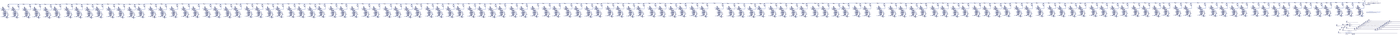
[diagram p0: schematic 128b_no_A_to_B.asc, whole sheet]
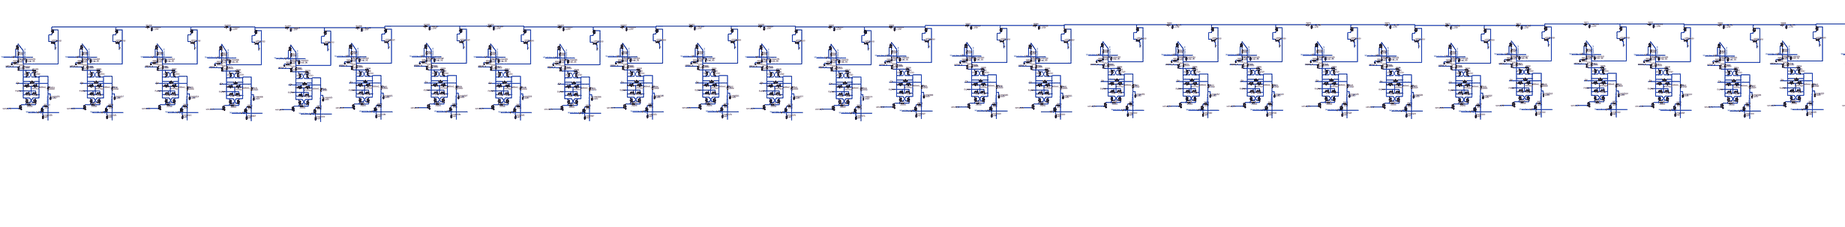
[diagram p1: schematic 128b_no_A_to_B.asc, part, row 1 of 1, column 1 of 5]
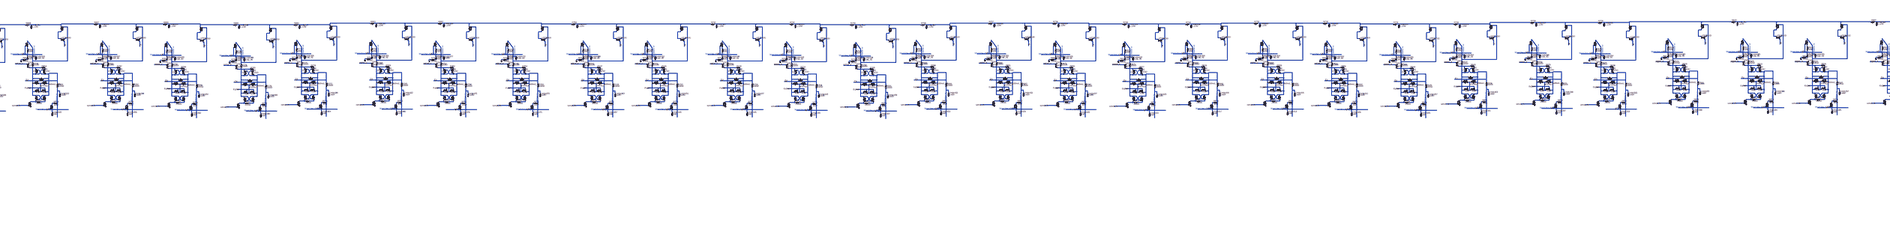
[diagram p2: schematic 128b_no_A_to_B.asc, part, row 1 of 1, column 2 of 5]
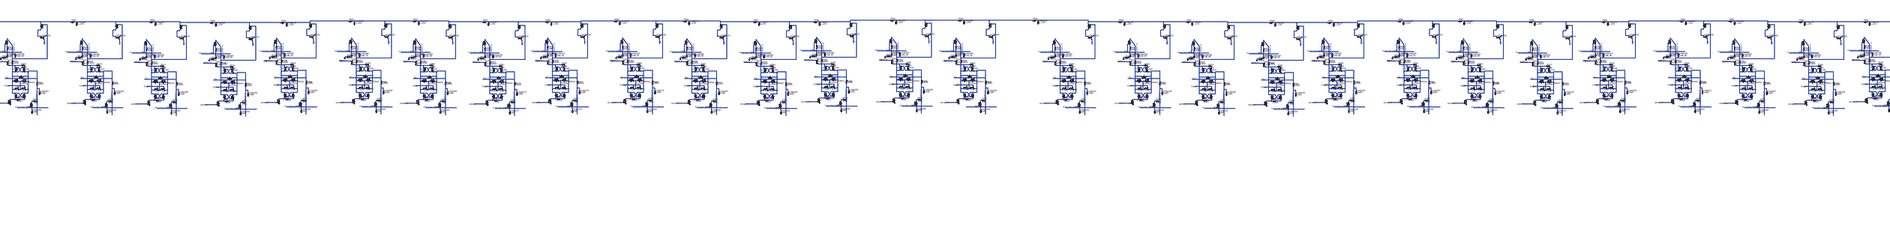
[diagram p3: schematic 128b_no_A_to_B.asc, part, row 1 of 1, column 3 of 5]
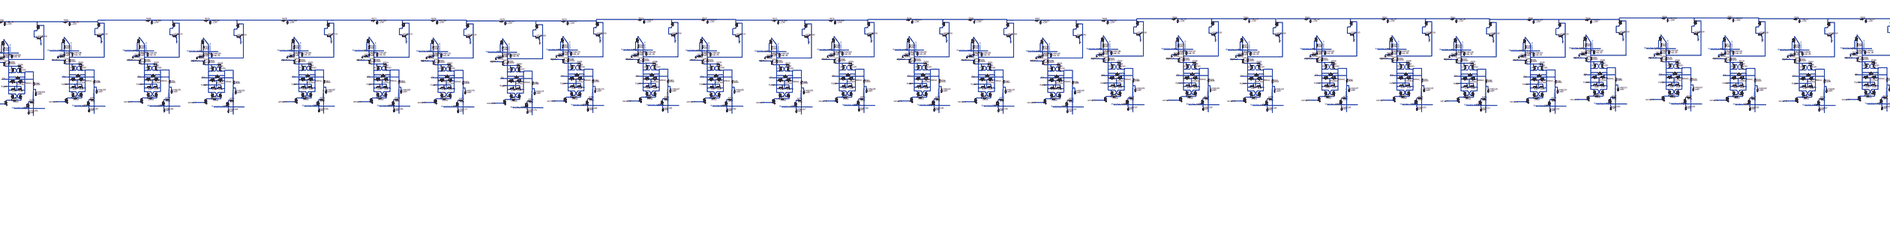
[diagram p4: schematic 128b_no_A_to_B.asc, part, row 1 of 1, column 4 of 5]
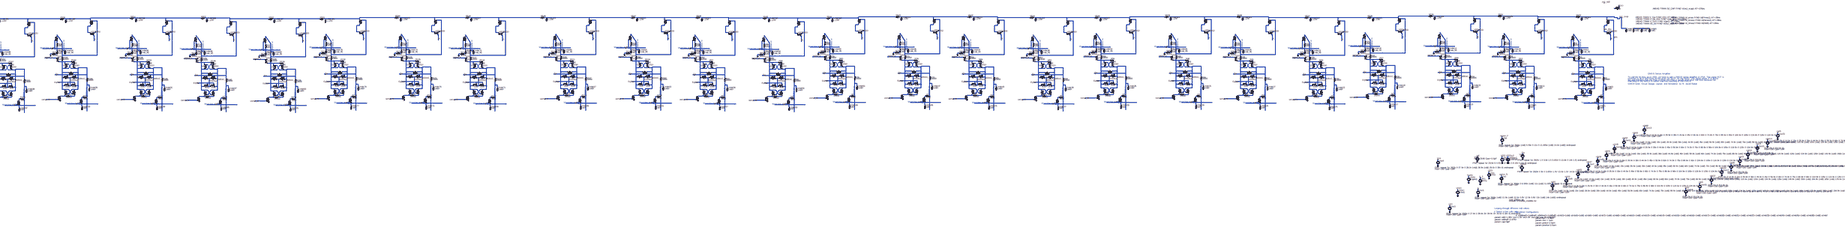
[diagram p5: schematic 128b_no_A_to_B.asc, part, row 1 of 1, column 5 of 5]
* 128b_no_A_to_B.asc
M1 N1046 sense_N 0 0 nmos45lp l=0.27um w=0.22um
VDD VDD 0 {vdd}
VDDby2 VDDby2 0 {vddhalf}
Vsp sense_P 0 PWL repeat for 20(6n {vdd} 6.05n 0 11n 0 11.005n {vdd} 14.0n {vdd}) endrepeat Rser=100 Cpar=10fF
M2 bitline1_1 bitline0_1 N1047 0 nmos45hp l=0.16um w={ntw}
M3 bitline0_1 bitline1_1 N1046 0 nmos45hp l=0.16um w={ntw}
M4 bitline1_1 Eq bitline0_1 0 nmos45hp l=0.16um w={prentw}
M5 bitline0_1 Eq VDDby2 0 nmos45hp l=0.16um w={prentw}
M6 VDDby2 Eq bitline1_1 0 nmos45hp l=0.16um w={prentw}
M7 gn1 ra0 N391 0 nmos45lp l=0.085um w=0.555um
Cmbit0 mb1 N519 24fF
M8 N1089 ra3 N1404 0 nmos45lp l=0.085um w=0.055um
Cmbit1 N1404 0 24fF
Vra0 ra0 0 PWL repeat for 20(4n 0 4.01n 2.9 9.9n 2.9 10n 0 14n 0) endrepeat Rser=2048 Cpar=0.6pF
M9 N634 sense_P VDD VDD pmos45lp l=0.27um w=0.22um
M10 bitline1_1 bitline0_1 N672 VDD pmos45hp l=0.16um w={tw}
M11 bitline0_1 bitline1_1 N634 VDD pmos45hp l=0.16um w={tw}
Vsn sense_N 0 PWL repeat for 20(6n 0 6.005n {vdd} 11n {vdd} 11.005n 0 14.0n 0) endrepeat Rser=100 Cpar=10fF
Cmbit2 gn1 0 {cap_bl}
Cmbit3 N903 0 144fF
R1 gn1 bitline0_1 10000
R2 bitline1_1 N903 10000
R4 0 N519 30000
R3 N391 mb1 1000
R5 N903 N1089 1000
R6 N672 N634 25000
R7 N1047 N1046 25000
M12 bitline0_1 EqNot VDDby2 VDD pmos45hp l=0.16um w={pretw}
M13 VDDby2 EqNot bitline1_1 VDD pmos45hp l=0.16um w={pretw}
Veq1 EqNot 0 PWL repeat for 20(0n 0 3n 0 3.001n 1.5V 13.9n 1.5V 14.0n 0) endrepeat
Veq2 Eq 0 PWL repeat for 20(0n 1.5 3.0n 1.5 3.001n 0 13.9n 0 14n 1.5) endrepeat
Cmbit4 N280 0 {cap}
Cmbit5 N280 0 {cap}
Cmbit6 N280 0 {cap}
Cmbit7 ns1_vcap 0 {cap}
M§NMOS1 dp_dn1 gn1 ns1_vcap 0 nmos45hp l=0.16um w={ntw}
M§PMOS1 dp_dn1 K VDD VDD pmos45hp l=0.16um w={tw}
VSS VSS 0 {vss}
M20 N001 ISO NC_01 0 nmos45hp l=0.16um w={ntw}
VSS1 Vgate 0 {vgate}
Vsn1 K 0 PWL repeat for 20(0n {vdd} 11.9n {vdd} 12.0n 0.8V 12.9n 0.8V 13n {vdd} 14n {vdd}) endrepeat Rser=100 Cpar=10fF
Vsn2 Vcp 0 PWL repeat for 20(0n 0 27.9n 0 28.0n {vdd} 28.9n {vdd} 29.0n 0 30n 0) endrepeat Rser=100 Cpar=10fF
VK1 K_1 0 {vk1}
VISO VISO 0 {viso}
Vsn3 ISO 0 PWL repeat for 20(0n 0 27.9n 0 28.0n 3V 29.5n 3V 29.6n 0 30n 0) endrepeat Rser=100 Cpar=10fF
M14 N1029 sense_N 0 0 nmos45lp l=0.27um w=0.22um
M15 bitline1_2 bitline0_2 N1030 0 nmos45hp l=0.16um w={ntw}
M16 bitline0_2 bitline1_2 N1029 0 nmos45hp l=0.16um w={ntw}
M17 bitline1_2 Eq bitline0_2 0 nmos45hp l=0.16um w={prentw}
M18 bitline0_2 Eq VDDby2 0 nmos45hp l=0.16um w={prentw}
M19 VDDby2 Eq bitline1_2 0 nmos45hp l=0.16um w={prentw}
M21 N048 ra0 N384 0 nmos45lp l=0.085um w=0.555um
Cmbit8 mb2 N511 24fF
M22 N1068 ra3 N1385 0 nmos45lp l=0.085um w=0.055um
Cmbit9 N1385 0 24fF
M23 N619 sense_P VDD VDD pmos45lp l=0.27um w=0.22um
M24 bitline1_2 bitline0_2 N653 VDD pmos45hp l=0.16um w={tw}
M25 bitline0_2 bitline1_2 N619 VDD pmos45hp l=0.16um w={tw}
Cmbit10 N048 0 {cap_bl}
Cmbit11 N896 0 144fF
R8 N048 bitline0_2 10000
R9 bitline1_2 N896 10000
R10 0 N511 30000
R11 N384 mb2 1000
R12 N896 N1068 1000
R13 N653 N619 25000
R14 N1030 N1029 25000
M26 bitline0_2 EqNot VDDby2 VDD pmos45hp l=0.16um w={pretw}
M27 VDDby2 EqNot bitline1_2 VDD pmos45hp l=0.16um w={pretw}
M§NMOS2 N183 N048 N004 0 nmos45hp l=0.16um w={ntw}
M§PMOS2 N183 K VDD VDD pmos45hp l=0.16um w={tw}
M28 N1016 sense_N 0 0 nmos45lp l=0.27um w=0.22um
M29 bitline1_3 bitline0_3 N1017 0 nmos45hp l=0.16um w={ntw}
M30 bitline0_3 bitline1_3 N1016 0 nmos45hp l=0.16um w={ntw}
M31 bitline1_3 Eq bitline0_3 0 nmos45hp l=0.16um w={prentw}
M32 bitline0_3 Eq VDDby2 0 nmos45hp l=0.16um w={prentw}
M33 VDDby2 Eq bitline1_3 0 nmos45hp l=0.16um w={prentw}
M34 N036 ra0 N379 0 nmos45lp l=0.085um w=0.555um
Cmbit12 mb3 N503 24fF
M35 N1045 ra3 N1364 0 nmos45lp l=0.085um w=0.055um
Cmbit13 N1364 0 24fF
M36 N605 sense_P VDD VDD pmos45lp l=0.27um w=0.22um
M37 bitline1_3 bitline0_3 N633 VDD pmos45hp l=0.16um w={tw}
M38 bitline0_3 bitline1_3 N605 VDD pmos45hp l=0.16um w={tw}
Cmbit14 N036 0 {cap_bl}
Cmbit15 N891 0 144fF
R15 N036 bitline0_3 10000
R16 bitline1_3 N891 10000
R17 0 N503 30000
R18 N379 mb3 1000
R19 N891 N1045 1000
R20 N633 N605 25000
R21 N1017 N1016 25000
M39 bitline0_3 EqNot VDDby2 VDD pmos45hp l=0.16um w={pretw}
M40 VDDby2 EqNot bitline1_3 VDD pmos45hp l=0.16um w={pretw}
M§NMOS3 N160 N036 N003 0 nmos45hp l=0.16um w={ntw}
M§PMOS3 N160 K VDD VDD pmos45hp l=0.16um w={tw}
M41 N1014 sense_N 0 0 nmos45lp l=0.27um w=0.22um
M42 bitline1_4 bitline0_4 N1015 0 nmos45hp l=0.16um w={ntw}
M43 bitline0_4 bitline1_4 N1014 0 nmos45hp l=0.16um w={ntw}
M44 bitline1_4 Eq bitline0_4 0 nmos45hp l=0.16um w={prentw}
M45 bitline0_4 Eq VDDby2 0 nmos45hp l=0.16um w={prentw}
M46 VDDby2 Eq bitline1_4 0 nmos45hp l=0.16um w={prentw}
M47 N035 ra0 N378 0 nmos45lp l=0.085um w=0.555um
Cmbit16 mb4 N502 24fF
M48 N1044 ra3 N1363 0 nmos45lp l=0.085um w=0.055um
Cmbit17 N1363 0 24fF
M49 N604 sense_P VDD VDD pmos45lp l=0.27um w=0.22um
M50 bitline1_4 bitline0_4 N632 VDD pmos45hp l=0.16um w={tw}
M51 bitline0_4 bitline1_4 N604 VDD pmos45hp l=0.16um w={tw}
Cmbit18 N035 0 {cap_bl}
Cmbit19 N890 0 144fF
R22 N035 bitline0_4 10000
R23 bitline1_4 N890 10000
R24 0 N502 30000
R25 N378 mb4 1000
R26 N890 N1044 1000
R27 N632 N604 25000
R28 N1015 N1014 25000
M52 bitline0_4 EqNot VDDby2 VDD pmos45hp l=0.16um w={pretw}
M53 VDDby2 EqNot bitline1_4 VDD pmos45hp l=0.16um w={pretw}
M§NMOS4 N159 N035 N002 0 nmos45hp l=0.16um w={ntw}
M§PMOS4 N159 K VDD VDD pmos45hp l=0.16um w={tw}
M54 N1066 sense_N 0 0 nmos45lp l=0.27um w=0.22um
M55 bitline1_5 bitline0_5 N1067 0 nmos45hp l=0.16um w={ntw}
M56 bitline0_5 bitline1_5 N1066 0 nmos45hp l=0.16um w={ntw}
M57 bitline1_5 Eq bitline0_5 0 nmos45hp l=0.16um w={prentw}
M58 bitline0_5 Eq VDDby2 0 nmos45hp l=0.16um w={prentw}
M59 VDDby2 Eq bitline1_5 0 nmos45hp l=0.16um w={prentw}
M60 N087 ra0 N399 0 nmos45lp l=0.085um w=0.555um
Cmbit20 mb5 N527 24fF
M61 N1113 ra3 N1419 0 nmos45lp l=0.085um w=0.055um
Cmbit21 N1419 0 24fF
M62 N652 sense_P VDD VDD pmos45lp l=0.27um w=0.22um
M63 bitline1_5 bitline0_5 N691 VDD pmos45hp l=0.16um w={tw}
M64 bitline0_5 bitline1_5 N652 VDD pmos45hp l=0.16um w={tw}
Cmbit22 N087 0 {cap_bl}
Cmbit23 N911 0 144fF
R29 N087 bitline0_5 10000
R30 bitline1_5 N911 10000
R31 0 N527 30000
R32 N399 mb5 1000
R33 N911 N1113 1000
R34 N691 N652 25000
R35 N1067 N1066 25000
M65 bitline0_5 EqNot VDDby2 VDD pmos45hp l=0.16um w={pretw}
M66 VDDby2 EqNot bitline1_5 VDD pmos45hp l=0.16um w={pretw}
M§NMOS5 N223 N087 N018 0 nmos45hp l=0.16um w={ntw}
M§PMOS5 N223 K VDD VDD pmos45hp l=0.16um w={tw}
M67 N1042 sense_N 0 0 nmos45lp l=0.27um w=0.22um
M68 bitline1_6 bitline0_6 N1043 0 nmos45hp l=0.16um w={ntw}
M69 bitline0_6 bitline1_6 N1042 0 nmos45hp l=0.16um w={ntw}
M70 bitline1_6 Eq bitline0_6 0 nmos45hp l=0.16um w={prentw}
M71 bitline0_6 Eq VDDby2 0 nmos45hp l=0.16um w={prentw}
M72 VDDby2 Eq bitline1_6 0 nmos45hp l=0.16um w={prentw}
M73 N066 ra0 N390 0 nmos45lp l=0.085um w=0.555um
Cmbit24 mb6 N518 24fF
M74 N1088 ra3 N1403 0 nmos45lp l=0.085um w=0.055um
Cmbit25 N1403 0 24fF
M75 N631 sense_P VDD VDD pmos45lp l=0.27um w=0.22um
M76 bitline1_6 bitline0_6 N671 VDD pmos45hp l=0.16um w={tw}
M77 bitline0_6 bitline1_6 N631 VDD pmos45hp l=0.16um w={tw}
Cmbit26 N066 0 {cap_bl}
Cmbit27 N902 0 144fF
R36 N066 bitline0_6 10000
R37 bitline1_6 N902 10000
R38 0 N518 30000
R39 N390 mb6 1000
R40 N902 N1088 1000
R41 N671 N631 25000
R42 N1043 N1042 25000
M78 bitline0_6 EqNot VDDby2 VDD pmos45hp l=0.16um w={pretw}
M79 VDDby2 EqNot bitline1_6 VDD pmos45hp l=0.16um w={pretw}
M§NMOS6 N200 N066 N010 0 nmos45hp l=0.16um w={ntw}
M§PMOS6 N200 K VDD VDD pmos45hp l=0.16um w={tw}
M80 N1027 sense_N 0 0 nmos45lp l=0.27um w=0.22um
M81 bitline1_7 bitline0_7 N1028 0 nmos45hp l=0.16um w={ntw}
M82 bitline0_7 bitline1_7 N1027 0 nmos45hp l=0.16um w={ntw}
M83 bitline1_7 Eq bitline0_7 0 nmos45hp l=0.16um w={prentw}
M84 bitline0_7 Eq VDDby2 0 nmos45hp l=0.16um w={prentw}
M85 VDDby2 Eq bitline1_7 0 nmos45hp l=0.16um w={prentw}
M86 N047 ra0 N383 0 nmos45lp l=0.085um w=0.555um
Cmbit28 mb7 N510 24fF
M87 N1065 ra3 N1384 0 nmos45lp l=0.085um w=0.055um
Cmbit29 N1384 0 24fF
M88 N618 sense_P VDD VDD pmos45lp l=0.27um w=0.22um
M89 bitline1_7 bitline0_7 N651 VDD pmos45hp l=0.16um w={tw}
M90 bitline0_7 bitline1_7 N618 VDD pmos45hp l=0.16um w={tw}
Cmbit30 N047 0 {cap_bl}
Cmbit31 N895 0 144fF
R43 N047 bitline0_7 10000
R44 bitline1_7 N895 10000
R45 0 N510 30000
R46 N383 mb7 1000
R47 N895 N1065 1000
R48 N651 N618 25000
R49 N1028 N1027 25000
M91 bitline0_7 EqNot VDDby2 VDD pmos45hp l=0.16um w={pretw}
M92 VDDby2 EqNot bitline1_7 VDD pmos45hp l=0.16um w={pretw}
M§NMOS7 N182 N047 N009 0 nmos45hp l=0.16um w={ntw}
M§PMOS7 N182 K VDD VDD pmos45hp l=0.16um w={tw}
M93 N1025 sense_N 0 0 nmos45lp l=0.27um w=0.22um
M94 bitline1_8 bitline0_8 N1026 0 nmos45hp l=0.16um w={ntw}
M95 bitline0_8 bitline1_8 N1025 0 nmos45hp l=0.16um w={ntw}
M96 bitline1_8 Eq bitline0_8 0 nmos45hp l=0.16um w={prentw}
M97 bitline0_8 Eq VDDby2 0 nmos45hp l=0.16um w={prentw}
M98 VDDby2 Eq bitline1_8 0 nmos45hp l=0.16um w={prentw}
M99 N046 ra0 N382 0 nmos45lp l=0.085um w=0.555um
Cmbit32 mb8 N509 24fF
M100 N1064 ra3 N1383 0 nmos45lp l=0.085um w=0.055um
Cmbit33 N1383 0 24fF
M101 N617 sense_P VDD VDD pmos45lp l=0.27um w=0.22um
M102 bitline1_8 bitline0_8 N650 VDD pmos45hp l=0.16um w={tw}
M103 bitline0_8 bitline1_8 N617 VDD pmos45hp l=0.16um w={tw}
Cmbit34 N046 0 {cap_bl}
Cmbit35 N894 0 144fF
R50 N046 bitline0_8 10000
R51 bitline1_8 N894 10000
R52 0 N509 30000
R53 N382 mb8 1000
R54 N894 N1064 1000
R55 N650 N617 25000
R56 N1026 N1025 25000
M104 bitline0_8 EqNot VDDby2 VDD pmos45hp l=0.16um w={pretw}
M105 VDDby2 EqNot bitline1_8 VDD pmos45hp l=0.16um w={pretw}
M§NMOS8 N181 N046 N008 0 nmos45hp l=0.16um w={ntw}
M§PMOS8 N181 K VDD VDD pmos45hp l=0.16um w={tw}
M106 N1062 sense_N 0 0 nmos45lp l=0.27um w=0.22um
M107 bitline1_9 bitline0_9 N1063 0 nmos45hp l=0.16um w={ntw}
M108 bitline0_9 bitline1_9 N1062 0 nmos45hp l=0.16um w={ntw}
M109 bitline1_9 Eq bitline0_9 0 nmos45hp l=0.16um w={prentw}
M110 bitline0_9 Eq VDDby2 0 nmos45hp l=0.16um w={prentw}
M111 VDDby2 Eq bitline1_9 0 nmos45hp l=0.16um w={prentw}
M112 N086 ra0 N398 0 nmos45lp l=0.085um w=0.555um
Cmbit36 mb9 N526 24fF
M113 N1112 ra3 N1418 0 nmos45lp l=0.085um w=0.055um
Cmbit37 N1418 0 24fF
M114 N649 sense_P VDD VDD pmos45lp l=0.27um w=0.22um
M115 bitline1_9 bitline0_9 N690 VDD pmos45hp l=0.16um w={tw}
M116 bitline0_9 bitline1_9 N649 VDD pmos45hp l=0.16um w={tw}
Cmbit38 N086 0 {cap_bl}
Cmbit39 N910 0 144fF
R57 N086 bitline0_9 10000
R58 bitline1_9 N910 10000
R59 0 N526 30000
R60 N398 mb9 1000
R61 N910 N1112 1000
R62 N690 N649 25000
R63 N1063 N1062 25000
M117 bitline0_9 EqNot VDDby2 VDD pmos45hp l=0.16um w={pretw}
M118 VDDby2 EqNot bitline1_9 VDD pmos45hp l=0.16um w={pretw}
M§NMOS9 N222 N086 N017 0 nmos45hp l=0.16um w={ntw}
M§PMOS9 N222 K VDD VDD pmos45hp l=0.16um w={tw}
M119 N1040 sense_N 0 0 nmos45lp l=0.27um w=0.22um
M120 bitline1_10 bitline0_10 N1041 0 nmos45hp l=0.16um w={ntw}
M121 bitline0_10 bitline1_10 N1040 0 nmos45hp l=0.16um w={ntw}
M122 bitline1_10 Eq bitline0_10 0 nmos45hp l=0.16um w={prentw}
M123 bitline0_10 Eq VDDby2 0 nmos45hp l=0.16um w={prentw}
M124 VDDby2 Eq bitline1_10 0 nmos45hp l=0.16um w={prentw}
M125 N065 ra0 N389 0 nmos45lp l=0.085um w=0.555um
Cmbit40 mb10 N517 24fF
M126 N1087 ra3 N1402 0 nmos45lp l=0.085um w=0.055um
Cmbit41 N1402 0 24fF
M127 N630 sense_P VDD VDD pmos45lp l=0.27um w=0.22um
M128 bitline1_10 bitline0_10 N670 VDD pmos45hp l=0.16um w={tw}
M129 bitline0_10 bitline1_10 N630 VDD pmos45hp l=0.16um w={tw}
Cmbit42 N065 0 {cap_bl}
Cmbit43 N901 0 144fF
R64 N065 bitline0_10 10000
R65 bitline1_10 N901 10000
R66 0 N517 30000
R67 N389 mb10 1000
R68 N901 N1087 1000
R69 N670 N630 25000
R70 N1041 N1040 25000
M130 bitline0_10 EqNot VDDby2 VDD pmos45hp l=0.16um w={pretw}
M131 VDDby2 EqNot bitline1_10 VDD pmos45hp l=0.16um w={pretw}
M§NMOS10 N199 N065 N007 0 nmos45hp l=0.16um w={ntw}
M§PMOS10 N199 K VDD VDD pmos45hp l=0.16um w={tw}
M132 N1023 sense_N 0 0 nmos45lp l=0.27um w=0.22um
M133 bitline1_11 bitline0_11 N1024 0 nmos45hp l=0.16um w={ntw}
M134 bitline0_11 bitline1_11 N1023 0 nmos45hp l=0.16um w={ntw}
M135 bitline1_11 Eq bitline0_11 0 nmos45hp l=0.16um w={prentw}
M136 bitline0_11 Eq VDDby2 0 nmos45hp l=0.16um w={prentw}
M137 VDDby2 Eq bitline1_11 0 nmos45hp l=0.16um w={prentw}
M138 N045 ra0 N381 0 nmos45lp l=0.085um w=0.555um
Cmbit44 mb11 N508 24fF
M139 N1061 ra3 N1382 0 nmos45lp l=0.085um w=0.055um
Cmbit45 N1382 0 24fF
M140 N616 sense_P VDD VDD pmos45lp l=0.27um w=0.22um
M141 bitline1_11 bitline0_11 N648 VDD pmos45hp l=0.16um w={tw}
M142 bitline0_11 bitline1_11 N616 VDD pmos45hp l=0.16um w={tw}
Cmbit46 N045 0 {cap_bl}
Cmbit47 N893 0 144fF
R71 N045 bitline0_11 10000
R72 bitline1_11 N893 10000
R73 0 N508 30000
R74 N381 mb11 1000
R75 N893 N1061 1000
R76 N648 N616 25000
R77 N1024 N1023 25000
M143 bitline0_11 EqNot VDDby2 VDD pmos45hp l=0.16um w={pretw}
M144 VDDby2 EqNot bitline1_11 VDD pmos45hp l=0.16um w={pretw}
M§NMOS11 N180 N045 N006 0 nmos45hp l=0.16um w={ntw}
M§PMOS11 N180 K VDD VDD pmos45hp l=0.16um w={tw}
M145 N1021 sense_N 0 0 nmos45lp l=0.27um w=0.22um
M146 bitline1_12 bitline0_12 N1022 0 nmos45hp l=0.16um w={ntw}
M147 bitline0_12 bitline1_12 N1021 0 nmos45hp l=0.16um w={ntw}
M148 bitline1_12 Eq bitline0_12 0 nmos45hp l=0.16um w={prentw}
M149 bitline0_12 Eq VDDby2 0 nmos45hp l=0.16um w={prentw}
M150 VDDby2 Eq bitline1_12 0 nmos45hp l=0.16um w={prentw}
M151 N044 ra0 N380 0 nmos45lp l=0.085um w=0.555um
Cmbit48 mb12 N507 24fF
M152 N1060 ra3 N1381 0 nmos45lp l=0.085um w=0.055um
Cmbit49 N1381 0 24fF
M153 N615 sense_P VDD VDD pmos45lp l=0.27um w=0.22um
M154 bitline1_12 bitline0_12 N647 VDD pmos45hp l=0.16um w={tw}
M155 bitline0_12 bitline1_12 N615 VDD pmos45hp l=0.16um w={tw}
Cmbit50 N044 0 {cap_bl}
Cmbit51 N892 0 144fF
R78 N044 bitline0_12 10000
R79 bitline1_12 N892 10000
R80 0 N507 30000
R81 N380 mb12 1000
R82 N892 N1060 1000
R83 N647 N615 25000
R84 N1022 N1021 25000
M156 bitline0_12 EqNot VDDby2 VDD pmos45hp l=0.16um w={pretw}
M157 VDDby2 EqNot bitline1_12 VDD pmos45hp l=0.16um w={pretw}
M§NMOS12 N179 N044 N005 0 nmos45hp l=0.16um w={ntw}
M§PMOS12 N179 K VDD VDD pmos45hp l=0.16um w={tw}
M158 N1085 sense_N 0 0 nmos45lp l=0.27um w=0.22um
M159 bitline1_13 bitline0_13 N1086 0 nmos45hp l=0.16um w={ntw}
M160 bitline0_13 bitline1_13 N1085 0 nmos45hp l=0.16um w={ntw}
M161 bitline1_13 Eq bitline0_13 0 nmos45hp l=0.16um w={prentw}
M162 bitline0_13 Eq VDDby2 0 nmos45hp l=0.16um w={prentw}
M163 VDDby2 Eq bitline1_13 0 nmos45hp l=0.16um w={prentw}
M164 N104 ra0 N406 0 nmos45lp l=0.085um w=0.555um
Cmbit52 mb13 N534 24fF
M165 N1138 ra3 N1429 0 nmos45lp l=0.085um w=0.055um
Cmbit53 N1429 0 24fF
M166 N669 sense_P VDD VDD pmos45lp l=0.27um w=0.22um
M167 bitline1_13 bitline0_13 N708 VDD pmos45hp l=0.16um w={tw}
M168 bitline0_13 bitline1_13 N669 VDD pmos45hp l=0.16um w={tw}
Cmbit54 N104 0 {cap_bl}
Cmbit55 N918 0 144fF
R85 N104 bitline0_13 10000
R86 bitline1_13 N918 10000
R87 0 N534 30000
R88 N406 mb13 1000
R89 N918 N1138 1000
R90 N708 N669 25000
R91 N1086 N1085 25000
M169 bitline0_13 EqNot VDDby2 VDD pmos45hp l=0.16um w={pretw}
M170 VDDby2 EqNot bitline1_13 VDD pmos45hp l=0.16um w={pretw}
M§NMOS13 N246 N104 N025 0 nmos45hp l=0.16um w={ntw}
M§PMOS13 N246 K VDD VDD pmos45hp l=0.16um w={tw}
M171 N1058 sense_N 0 0 nmos45lp l=0.27um w=0.22um
M172 bitline1_14 bitline0_14 N1059 0 nmos45hp l=0.16um w={ntw}
M173 bitline0_14 bitline1_14 N1058 0 nmos45hp l=0.16um w={ntw}
M174 bitline1_14 Eq bitline0_14 0 nmos45hp l=0.16um w={prentw}
M175 bitline0_14 Eq VDDby2 0 nmos45hp l=0.16um w={prentw}
M176 VDDby2 Eq bitline1_14 0 nmos45hp l=0.16um w={prentw}
M177 N085 ra0 N397 0 nmos45lp l=0.085um w=0.555um
Cmbit56 mb14 N525 24fF
M178 N1111 ra3 N1417 0 nmos45lp l=0.085um w=0.055um
Cmbit57 N1417 0 24fF
M179 N646 sense_P VDD VDD pmos45lp l=0.27um w=0.22um
M180 bitline1_14 bitline0_14 N689 VDD pmos45hp l=0.16um w={tw}
M181 bitline0_14 bitline1_14 N646 VDD pmos45hp l=0.16um w={tw}
Cmbit58 N085 0 {cap_bl}
Cmbit59 N909 0 144fF
R92 N085 bitline0_14 10000
R93 bitline1_14 N909 10000
R94 0 N525 30000
R95 N397 mb14 1000
R96 N909 N1111 1000
R97 N689 N646 25000
R98 N1059 N1058 25000
M182 bitline0_14 EqNot VDDby2 VDD pmos45hp l=0.16um w={pretw}
M183 VDDby2 EqNot bitline1_14 VDD pmos45hp l=0.16um w={pretw}
M§NMOS14 N221 N085 N016 0 nmos45hp l=0.16um w={ntw}
M§PMOS14 N221 K VDD VDD pmos45hp l=0.16um w={tw}
M184 N1038 sense_N 0 0 nmos45lp l=0.27um w=0.22um
M185 bitline1_15 bitline0_15 N1039 0 nmos45hp l=0.16um w={ntw}
M186 bitline0_15 bitline1_15 N1038 0 nmos45hp l=0.16um w={ntw}
M187 bitline1_15 Eq bitline0_15 0 nmos45hp l=0.16um w={prentw}
M188 bitline0_15 Eq VDDby2 0 nmos45hp l=0.16um w={prentw}
M189 VDDby2 Eq bitline1_15 0 nmos45hp l=0.16um w={prentw}
M190 N064 ra0 N388 0 nmos45lp l=0.085um w=0.555um
Cmbit60 mb15 N516 24fF
M191 N1084 ra3 N1401 0 nmos45lp l=0.085um w=0.055um
Cmbit61 N1401 0 24fF
M192 N629 sense_P VDD VDD pmos45lp l=0.27um w=0.22um
M193 bitline1_15 bitline0_15 N668 VDD pmos45hp l=0.16um w={tw}
M194 bitline0_15 bitline1_15 N629 VDD pmos45hp l=0.16um w={tw}
Cmbit62 N064 0 {cap_bl}
Cmbit63 N900 0 144fF
R99 N064 bitline0_15 10000
R100 bitline1_15 N900 10000
R101 0 N516 30000
R102 N388 mb15 1000
R103 N900 N1084 1000
R104 N668 N629 25000
R105 N1039 N1038 25000
M195 bitline0_15 EqNot VDDby2 VDD pmos45hp l=0.16um w={pretw}
M196 VDDby2 EqNot bitline1_15 VDD pmos45hp l=0.16um w={pretw}
M§NMOS15 N198 N064 N015 0 nmos45hp l=0.16um w={ntw}
M§PMOS15 N198 K VDD VDD pmos45hp l=0.16um w={tw}
M197 N1036 sense_N 0 0 nmos45lp l=0.27um w=0.22um
M198 bitline1_16 bitline0_16 N1037 0 nmos45hp l=0.16um w={ntw}
M199 bitline0_16 bitline1_16 N1036 0 nmos45hp l=0.16um w={ntw}
M200 bitline1_16 Eq bitline0_16 0 nmos45hp l=0.16um w={prentw}
M201 bitline0_16 Eq VDDby2 0 nmos45hp l=0.16um w={prentw}
M202 VDDby2 Eq bitline1_16 0 nmos45hp l=0.16um w={prentw}
M203 N063 ra0 N387 0 nmos45lp l=0.085um w=0.555um
Cmbit64 mb16 N515 24fF
M204 N1083 ra3 N1400 0 nmos45lp l=0.085um w=0.055um
Cmbit65 N1400 0 24fF
M205 N628 sense_P VDD VDD pmos45lp l=0.27um w=0.22um
M206 bitline1_16 bitline0_16 N667 VDD pmos45hp l=0.16um w={tw}
M207 bitline0_16 bitline1_16 N628 VDD pmos45hp l=0.16um w={tw}
Cmbit66 N063 0 {cap_bl}
Cmbit67 N899 0 144fF
R106 N063 bitline0_16 10000
R107 bitline1_16 N899 10000
R108 0 N515 30000
R109 N387 mb16 1000
R110 N899 N1083 1000
R111 N667 N628 25000
R112 N1037 N1036 25000
M208 bitline0_16 EqNot VDDby2 VDD pmos45hp l=0.16um w={pretw}
M209 VDDby2 EqNot bitline1_16 VDD pmos45hp l=0.16um w={pretw}
M§NMOS16 N197 N063 N014 0 nmos45hp l=0.16um w={ntw}
M§PMOS16 N197 K VDD VDD pmos45hp l=0.16um w={tw}
M210 N1056 sense_N 0 0 nmos45lp l=0.27um w=0.22um
M211 bitline1_17 bitline0_17 N1057 0 nmos45hp l=0.16um w={ntw}
M212 bitline0_17 bitline1_17 N1056 0 nmos45hp l=0.16um w={ntw}
M213 bitline1_17 Eq bitline0_17 0 nmos45hp l=0.16um w={prentw}
M214 bitline0_17 Eq VDDby2 0 nmos45hp l=0.16um w={prentw}
M215 VDDby2 Eq bitline1_17 0 nmos45hp l=0.16um w={prentw}
M216 N084 ra0 N396 0 nmos45lp l=0.085um w=0.555um
Cmbit68 mb17 N524 24fF
M217 N1110 ra3 N1416 0 nmos45lp l=0.085um w=0.055um
Cmbit69 N1416 0 24fF
M218 N645 sense_P VDD VDD pmos45lp l=0.27um w=0.22um
M219 bitline1_17 bitline0_17 N688 VDD pmos45hp l=0.16um w={tw}
M220 bitline0_17 bitline1_17 N645 VDD pmos45hp l=0.16um w={tw}
Cmbit70 N084 0 {cap_bl}
Cmbit71 N908 0 144fF
R113 N084 bitline0_17 10000
R114 bitline1_17 N908 10000
R115 0 N524 30000
R116 N396 mb17 1000
R117 N908 N1110 1000
R118 N688 N645 25000
R119 N1057 N1056 25000
M221 bitline0_17 EqNot VDDby2 VDD pmos45hp l=0.16um w={pretw}
M222 VDDby2 EqNot bitline1_17 VDD pmos45hp l=0.16um w={pretw}
M§NMOS17 N220 N084 N013 0 nmos45hp l=0.16um w={ntw}
M§PMOS17 N220 K VDD VDD pmos45hp l=0.16um w={tw}
M223 N1034 sense_N 0 0 nmos45lp l=0.27um w=0.22um
M224 bitline1_18 bitline0_18 N1035 0 nmos45hp l=0.16um w={ntw}
M225 bitline0_18 bitline1_18 N1034 0 nmos45hp l=0.16um w={ntw}
M226 bitline1_18 Eq bitline0_18 0 nmos45hp l=0.16um w={prentw}
M227 bitline0_18 Eq VDDby2 0 nmos45hp l=0.16um w={prentw}
M228 VDDby2 Eq bitline1_18 0 nmos45hp l=0.16um w={prentw}
M229 N062 ra0 N386 0 nmos45lp l=0.085um w=0.555um
Cmbit72 mb18 N514 24fF
M230 N1082 ra3 N1399 0 nmos45lp l=0.085um w=0.055um
Cmbit73 N1399 0 24fF
M231 N627 sense_P VDD VDD pmos45lp l=0.27um w=0.22um
M232 bitline1_18 bitline0_18 N666 VDD pmos45hp l=0.16um w={tw}
M233 bitline0_18 bitline1_18 N627 VDD pmos45hp l=0.16um w={tw}
Cmbit74 N062 0 {cap_bl}
Cmbit75 N898 0 144fF
R120 N062 bitline0_18 10000
R121 bitline1_18 N898 10000
R122 0 N514 30000
R123 N386 mb18 1000
R124 N898 N1082 1000
R125 N666 N627 25000
R126 N1035 N1034 25000
M234 bitline0_18 EqNot VDDby2 VDD pmos45hp l=0.16um w={pretw}
M235 VDDby2 EqNot bitline1_18 VDD pmos45hp l=0.16um w={pretw}
M§NMOS18 N196 N062 N012 0 nmos45hp l=0.16um w={ntw}
M§PMOS18 N196 K VDD VDD pmos45hp l=0.16um w={tw}
M236 N1032 sense_N 0 0 nmos45lp l=0.27um w=0.22um
M237 bitline1_19 bitline0_19 N1033 0 nmos45hp l=0.16um w={ntw}
M238 bitline0_19 bitline1_19 N1032 0 nmos45hp l=0.16um w={ntw}
M239 bitline1_19 Eq bitline0_19 0 nmos45hp l=0.16um w={prentw}
M240 bitline0_19 Eq VDDby2 0 nmos45hp l=0.16um w={prentw}
M241 VDDby2 Eq bitline1_19 0 nmos45hp l=0.16um w={prentw}
M242 N061 ra0 N385 0 nmos45lp l=0.085um w=0.555um
Cmbit76 mb19 N513 24fF
M243 N1081 ra3 N1398 0 nmos45lp l=0.085um w=0.055um
Cmbit77 N1398 0 24fF
M244 N626 sense_P VDD VDD pmos45lp l=0.27um w=0.22um
M245 bitline1_19 bitline0_19 N665 VDD pmos45hp l=0.16um w={tw}
M246 bitline0_19 bitline1_19 N626 VDD pmos45hp l=0.16um w={tw}
Cmbit78 N061 0 {cap_bl}
Cmbit79 N897 0 144fF
R127 N061 bitline0_19 10000
R128 bitline1_19 N897 10000
R129 0 N513 30000
R130 N385 mb19 1000
R131 N897 N1081 1000
R132 N665 N626 25000
R133 N1033 N1032 25000
M247 bitline0_19 EqNot VDDby2 VDD pmos45hp l=0.16um w={pretw}
M248 VDDby2 EqNot bitline1_19 VDD pmos45hp l=0.16um w={pretw}
M§NMOS19 N195 N061 N011 0 nmos45hp l=0.16um w={ntw}
M§PMOS19 N195 K VDD VDD pmos45hp l=0.16um w={tw}
M249 N1108 sense_N 0 0 nmos45lp l=0.27um w=0.22um
M250 bitline1_20 bitline0_20 N1109 0 nmos45hp l=0.16um w={ntw}
M251 bitline0_20 bitline1_20 N1108 0 nmos45hp l=0.16um w={ntw}
M252 bitline1_20 Eq bitline0_20 0 nmos45hp l=0.16um w={prentw}
M253 bitline0_20 Eq VDDby2 0 nmos45hp l=0.16um w={prentw}
M254 VDDby2 Eq bitline1_20 0 nmos45hp l=0.16um w={prentw}
M255 N116 ra0 N414 0 nmos45lp l=0.085um w=0.555um
Cmbit80 mb20 N542 24fF
M256 N1172 ra3 N1438 0 nmos45lp l=0.085um w=0.055um
Cmbit81 N1438 0 24fF
M257 N687 sense_P VDD VDD pmos45lp l=0.27um w=0.22um
M258 bitline1_20 bitline0_20 N729 VDD pmos45hp l=0.16um w={tw}
M259 bitline0_20 bitline1_20 N687 VDD pmos45hp l=0.16um w={tw}
Cmbit82 N116 0 {cap_bl}
Cmbit83 N926 0 144fF
R134 N116 bitline0_20 10000
R135 bitline1_20 N926 10000
R136 0 N542 30000
R137 N414 mb20 1000
R138 N926 N1172 1000
R139 N729 N687 25000
R140 N1109 N1108 25000
M260 bitline0_20 EqNot VDDby2 VDD pmos45hp l=0.16um w={pretw}
M261 VDDby2 EqNot bitline1_20 VDD pmos45hp l=0.16um w={pretw}
M§NMOS20 N264 N116 N034 0 nmos45hp l=0.16um w={ntw}
M§PMOS20 N264 K VDD VDD pmos45hp l=0.16um w={tw}
M262 N1079 sense_N 0 0 nmos45lp l=0.27um w=0.22um
M263 bitline1_21 bitline0_21 N1080 0 nmos45hp l=0.16um w={ntw}
M264 bitline0_21 bitline1_21 N1079 0 nmos45hp l=0.16um w={ntw}
M265 bitline1_21 Eq bitline0_21 0 nmos45hp l=0.16um w={prentw}
M266 bitline0_21 Eq VDDby2 0 nmos45hp l=0.16um w={prentw}
M267 VDDby2 Eq bitline1_21 0 nmos45hp l=0.16um w={prentw}
M268 N103 ra0 N405 0 nmos45lp l=0.085um w=0.555um
Cmbit84 mb21 N533 24fF
M269 N1137 ra3 N1428 0 nmos45lp l=0.085um w=0.055um
Cmbit85 N1428 0 24fF
M270 N664 sense_P VDD VDD pmos45lp l=0.27um w=0.22um
M271 bitline1_21 bitline0_21 N707 VDD pmos45hp l=0.16um w={tw}
M272 bitline0_21 bitline1_21 N664 VDD pmos45hp l=0.16um w={tw}
Cmbit86 N103 0 {cap_bl}
Cmbit87 N917 0 144fF
R141 N103 bitline0_21 10000
R142 bitline1_21 N917 10000
R143 0 N533 30000
R144 N405 mb21 1000
R145 N917 N1137 1000
R146 N707 N664 25000
R147 N1080 N1079 25000
M273 bitline0_21 EqNot VDDby2 VDD pmos45hp l=0.16um w={pretw}
M274 VDDby2 EqNot bitline1_21 VDD pmos45hp l=0.16um w={pretw}
M§NMOS21 N245 N103 N024 0 nmos45hp l=0.16um w={ntw}
M§PMOS21 N245 K VDD VDD pmos45hp l=0.16um w={tw}
M275 N1054 sense_N 0 0 nmos45lp l=0.27um w=0.22um
M276 bitline1_22 bitline0_22 N1055 0 nmos45hp l=0.16um w={ntw}
M277 bitline0_22 bitline1_22 N1054 0 nmos45hp l=0.16um w={ntw}
M278 bitline1_22 Eq bitline0_22 0 nmos45hp l=0.16um w={prentw}
M279 bitline0_22 Eq VDDby2 0 nmos45hp l=0.16um w={prentw}
M280 VDDby2 Eq bitline1_22 0 nmos45hp l=0.16um w={prentw}
M281 N083 ra0 N395 0 nmos45lp l=0.085um w=0.555um
Cmbit88 mb22 N523 24fF
M282 N1107 ra3 N1415 0 nmos45lp l=0.085um w=0.055um
Cmbit89 N1415 0 24fF
M283 N644 sense_P VDD VDD pmos45lp l=0.27um w=0.22um
M284 bitline1_22 bitline0_22 N686 VDD pmos45hp l=0.16um w={tw}
M285 bitline0_22 bitline1_22 N644 VDD pmos45hp l=0.16um w={tw}
Cmbit90 N083 0 {cap_bl}
Cmbit91 N907 0 144fF
R148 N083 bitline0_22 10000
R149 bitline1_22 N907 10000
R150 0 N523 30000
R151 N395 mb22 1000
R152 N907 N1107 1000
R153 N686 N644 25000
R154 N1055 N1054 25000
M286 bitline0_22 EqNot VDDby2 VDD pmos45hp l=0.16um w={pretw}
M287 VDDby2 EqNot bitline1_22 VDD pmos45hp l=0.16um w={pretw}
M§NMOS22 N219 N083 N023 0 nmos45hp l=0.16um w={ntw}
M§PMOS22 N219 K VDD VDD pmos45hp l=0.16um w={tw}
M288 N1052 sense_N 0 0 nmos45lp l=0.27um w=0.22um
M289 bitline1_23 bitline0_23 N1053 0 nmos45hp l=0.16um w={ntw}
M290 bitline0_23 bitline1_23 N1052 0 nmos45hp l=0.16um w={ntw}
M291 bitline1_23 Eq bitline0_23 0 nmos45hp l=0.16um w={prentw}
M292 bitline0_23 Eq VDDby2 0 nmos45hp l=0.16um w={prentw}
M293 VDDby2 Eq bitline1_23 0 nmos45hp l=0.16um w={prentw}
M294 N082 ra0 N394 0 nmos45lp l=0.085um w=0.555um
Cmbit92 mb23 N522 24fF
M295 N1106 ra3 N1414 0 nmos45lp l=0.085um w=0.055um
Cmbit93 N1414 0 24fF
M296 N643 sense_P VDD VDD pmos45lp l=0.27um w=0.22um
M297 bitline1_23 bitline0_23 N685 VDD pmos45hp l=0.16um w={tw}
M298 bitline0_23 bitline1_23 N643 VDD pmos45hp l=0.16um w={tw}
Cmbit94 N082 0 {cap_bl}
Cmbit95 N906 0 144fF
R155 N082 bitline0_23 10000
R156 bitline1_23 N906 10000
R157 0 N522 30000
R158 N394 mb23 1000
R159 N906 N1106 1000
R160 N685 N643 25000
R161 N1053 N1052 25000
M299 bitline0_23 EqNot VDDby2 VDD pmos45hp l=0.16um w={pretw}
M300 VDDby2 EqNot bitline1_23 VDD pmos45hp l=0.16um w={pretw}
M§NMOS23 N218 N082 N022 0 nmos45hp l=0.16um w={ntw}
M§PMOS23 N218 K VDD VDD pmos45hp l=0.16um w={tw}
M301 N1104 sense_N 0 0 nmos45lp l=0.27um w=0.22um
M302 bitline1_24 bitline0_24 N1105 0 nmos45hp l=0.16um w={ntw}
M303 bitline0_24 bitline1_24 N1104 0 nmos45hp l=0.16um w={ntw}
M304 bitline1_24 Eq bitline0_24 0 nmos45hp l=0.16um w={prentw}
M305 bitline0_24 Eq VDDby2 0 nmos45hp l=0.16um w={prentw}
M306 VDDby2 Eq bitline1_24 0 nmos45hp l=0.16um w={prentw}
M307 N115 ra0 N413 0 nmos45lp l=0.085um w=0.555um
Cmbit96 mb24 N541 24fF
M308 N1171 ra3 N1437 0 nmos45lp l=0.085um w=0.055um
Cmbit97 N1437 0 24fF
M309 N684 sense_P VDD VDD pmos45lp l=0.27um w=0.22um
M310 bitline1_24 bitline0_24 N728 VDD pmos45hp l=0.16um w={tw}
M311 bitline0_24 bitline1_24 N684 VDD pmos45hp l=0.16um w={tw}
Cmbit98 N115 0 {cap_bl}
Cmbit99 N925 0 144fF
R162 N115 bitline0_24 10000
R163 bitline1_24 N925 10000
R164 0 N541 30000
R165 N413 mb24 1000
R166 N925 N1171 1000
R167 N728 N684 25000
R168 N1105 N1104 25000
M312 bitline0_24 EqNot VDDby2 VDD pmos45hp l=0.16um w={pretw}
M313 VDDby2 EqNot bitline1_24 VDD pmos45hp l=0.16um w={pretw}
M§NMOS24 N263 N115 N033 0 nmos45hp l=0.16um w={ntw}
M§PMOS24 N263 K VDD VDD pmos45hp l=0.16um w={tw}
M314 N1077 sense_N 0 0 nmos45lp l=0.27um w=0.22um
M315 bitline1_25 bitline0_25 N1078 0 nmos45hp l=0.16um w={ntw}
M316 bitline0_25 bitline1_25 N1077 0 nmos45hp l=0.16um w={ntw}
M317 bitline1_25 Eq bitline0_25 0 nmos45hp l=0.16um w={prentw}
M318 bitline0_25 Eq VDDby2 0 nmos45hp l=0.16um w={prentw}
M319 VDDby2 Eq bitline1_25 0 nmos45hp l=0.16um w={prentw}
M320 N102 ra0 N404 0 nmos45lp l=0.085um w=0.555um
Cmbit100 mb25 N532 24fF
M321 N1136 ra3 N1427 0 nmos45lp l=0.085um w=0.055um
Cmbit101 N1427 0 24fF
M322 N663 sense_P VDD VDD pmos45lp l=0.27um w=0.22um
M323 bitline1_25 bitline0_25 N706 VDD pmos45hp l=0.16um w={tw}
M324 bitline0_25 bitline1_25 N663 VDD pmos45hp l=0.16um w={tw}
Cmbit102 N102 0 {cap_bl}
Cmbit103 N916 0 144fF
R169 N102 bitline0_25 10000
R170 bitline1_25 N916 10000
R171 0 N532 30000
R172 N404 mb25 1000
R173 N916 N1136 1000
R174 N706 N663 25000
R175 N1078 N1077 25000
M325 bitline0_25 EqNot VDDby2 VDD pmos45hp l=0.16um w={pretw}
M326 VDDby2 EqNot bitline1_25 VDD pmos45hp l=0.16um w={pretw}
M§NMOS25 N244 N102 N021 0 nmos45hp l=0.16um w={ntw}
M§PMOS25 N244 K VDD VDD pmos45hp l=0.16um w={tw}
M327 N1050 sense_N 0 0 nmos45lp l=0.27um w=0.22um
M328 bitline1_26 bitline0_26 N1051 0 nmos45hp l=0.16um w={ntw}
M329 bitline0_26 bitline1_26 N1050 0 nmos45hp l=0.16um w={ntw}
M330 bitline1_26 Eq bitline0_26 0 nmos45hp l=0.16um w={prentw}
M331 bitline0_26 Eq VDDby2 0 nmos45hp l=0.16um w={prentw}
M332 VDDby2 Eq bitline1_26 0 nmos45hp l=0.16um w={prentw}
M333 N081 ra0 N393 0 nmos45lp l=0.085um w=0.555um
Cmbit104 mb26 N521 24fF
M334 N1103 ra3 N1413 0 nmos45lp l=0.085um w=0.055um
Cmbit105 N1413 0 24fF
M335 N642 sense_P VDD VDD pmos45lp l=0.27um w=0.22um
M336 bitline1_26 bitline0_26 N683 VDD pmos45hp l=0.16um w={tw}
M337 bitline0_26 bitline1_26 N642 VDD pmos45hp l=0.16um w={tw}
Cmbit106 N081 0 {cap_bl}
Cmbit107 N905 0 144fF
R176 N081 bitline0_26 10000
R177 bitline1_26 N905 10000
R178 0 N521 30000
R179 N393 mb26 1000
R180 N905 N1103 1000
R181 N683 N642 25000
R182 N1051 N1050 25000
M338 bitline0_26 EqNot VDDby2 VDD pmos45hp l=0.16um w={pretw}
M339 VDDby2 EqNot bitline1_26 VDD pmos45hp l=0.16um w={pretw}
M§NMOS26 N217 N081 N020 0 nmos45hp l=0.16um w={ntw}
M§PMOS26 N217 K VDD VDD pmos45hp l=0.16um w={tw}
M340 N1048 sense_N 0 0 nmos45lp l=0.27um w=0.22um
M341 bitline1_27 bitline0_27 N1049 0 nmos45hp l=0.16um w={ntw}
M342 bitline0_27 bitline1_27 N1048 0 nmos45hp l=0.16um w={ntw}
M343 bitline1_27 Eq bitline0_27 0 nmos45hp l=0.16um w={prentw}
M344 bitline0_27 Eq VDDby2 0 nmos45hp l=0.16um w={prentw}
M345 VDDby2 Eq bitline1_27 0 nmos45hp l=0.16um w={prentw}
M346 N080 ra0 N392 0 nmos45lp l=0.085um w=0.555um
Cmbit108 mb27 N520 24fF
M347 N1102 ra3 N1412 0 nmos45lp l=0.085um w=0.055um
Cmbit109 N1412 0 24fF
M348 N641 sense_P VDD VDD pmos45lp l=0.27um w=0.22um
M349 bitline1_27 bitline0_27 N682 VDD pmos45hp l=0.16um w={tw}
M350 bitline0_27 bitline1_27 N641 VDD pmos45hp l=0.16um w={tw}
Cmbit110 N080 0 {cap_bl}
Cmbit111 N904 0 144fF
R183 N080 bitline0_27 10000
R184 bitline1_27 N904 10000
R185 0 N520 30000
R186 N392 mb27 1000
R187 N904 N1102 1000
R188 N682 N641 25000
R189 N1049 N1048 25000
M351 bitline0_27 EqNot VDDby2 VDD pmos45hp l=0.16um w={pretw}
M352 VDDby2 EqNot bitline1_27 VDD pmos45hp l=0.16um w={pretw}
M§NMOS27 N216 N080 N019 0 nmos45hp l=0.16um w={ntw}
M§PMOS27 N216 K VDD VDD pmos45hp l=0.16um w={tw}
M353 N1134 sense_N 0 0 nmos45lp l=0.27um w=0.22um
M354 bitline1_28 bitline0_28 N1135 0 nmos45hp l=0.16um w={ntw}
M355 bitline0_28 bitline1_28 N1134 0 nmos45hp l=0.16um w={ntw}
M356 bitline1_28 Eq bitline0_28 0 nmos45hp l=0.16um w={prentw}
M357 bitline0_28 Eq VDDby2 0 nmos45hp l=0.16um w={prentw}
M358 VDDby2 Eq bitline1_28 0 nmos45hp l=0.16um w={prentw}
M359 N134 ra0 N423 0 nmos45lp l=0.085um w=0.555um
Cmbit112 mb28 N551 24fF
M360 N1203 ra3 N1447 0 nmos45lp l=0.085um w=0.055um
Cmbit113 N1447 0 24fF
M361 N705 sense_P VDD VDD pmos45lp l=0.27um w=0.22um
M362 bitline1_28 bitline0_28 N749 VDD pmos45hp l=0.16um w={tw}
M363 bitline0_28 bitline1_28 N705 VDD pmos45hp l=0.16um w={tw}
Cmbit114 N134 0 {cap_bl}
Cmbit115 N935 0 144fF
R190 N134 bitline0_28 10000
R191 bitline1_28 N935 10000
R192 0 N551 30000
R193 N423 mb28 1000
R194 N935 N1203 1000
R195 N749 N705 25000
R196 N1135 N1134 25000
M364 bitline0_28 EqNot VDDby2 VDD pmos45hp l=0.16um w={pretw}
M365 VDDby2 EqNot bitline1_28 VDD pmos45hp l=0.16um w={pretw}
M§NMOS28 N279 N134 N043 0 nmos45hp l=0.16um w={ntw}
M§PMOS28 N279 K VDD VDD pmos45hp l=0.16um w={tw}
M366 N1100 sense_N 0 0 nmos45lp l=0.27um w=0.22um
M367 bitline1_29 bitline0_29 N1101 0 nmos45hp l=0.16um w={ntw}
M368 bitline0_29 bitline1_29 N1100 0 nmos45hp l=0.16um w={ntw}
M369 bitline1_29 Eq bitline0_29 0 nmos45hp l=0.16um w={prentw}
M370 bitline0_29 Eq VDDby2 0 nmos45hp l=0.16um w={prentw}
M371 VDDby2 Eq bitline1_29 0 nmos45hp l=0.16um w={prentw}
M372 N114 ra0 N412 0 nmos45lp l=0.085um w=0.555um
Cmbit116 mb29 N540 24fF
M373 N1170 ra3 N1436 0 nmos45lp l=0.085um w=0.055um
Cmbit117 N1436 0 24fF
M374 N681 sense_P VDD VDD pmos45lp l=0.27um w=0.22um
M375 bitline1_29 bitline0_29 N727 VDD pmos45hp l=0.16um w={tw}
M376 bitline0_29 bitline1_29 N681 VDD pmos45hp l=0.16um w={tw}
Cmbit118 N114 0 {cap_bl}
Cmbit119 N924 0 144fF
R197 N114 bitline0_29 10000
R198 bitline1_29 N924 10000
R199 0 N540 30000
R200 N412 mb29 1000
R201 N924 N1170 1000
R202 N727 N681 25000
R203 N1101 N1100 25000
M377 bitline0_29 EqNot VDDby2 VDD pmos45hp l=0.16um w={pretw}
M378 VDDby2 EqNot bitline1_29 VDD pmos45hp l=0.16um w={pretw}
M§NMOS29 N262 N114 N032 0 nmos45hp l=0.16um w={ntw}
M§PMOS29 N262 K VDD VDD pmos45hp l=0.16um w={tw}
M379 N1075 sense_N 0 0 nmos45lp l=0.27um w=0.22um
M380 bitline1_30 bitline0_30 N1076 0 nmos45hp l=0.16um w={ntw}
M381 bitline0_30 bitline1_30 N1075 0 nmos45hp l=0.16um w={ntw}
M382 bitline1_30 Eq bitline0_30 0 nmos45hp l=0.16um w={prentw}
M383 bitline0_30 Eq VDDby2 0 nmos45hp l=0.16um w={prentw}
M384 VDDby2 Eq bitline1_30 0 nmos45hp l=0.16um w={prentw}
M385 N101 ra0 N403 0 nmos45lp l=0.085um w=0.555um
Cmbit120 mb30 N531 24fF
M386 N1133 ra3 N1426 0 nmos45lp l=0.085um w=0.055um
Cmbit121 N1426 0 24fF
M387 N662 sense_P VDD VDD pmos45lp l=0.27um w=0.22um
M388 bitline1_30 bitline0_30 N704 VDD pmos45hp l=0.16um w={tw}
M389 bitline0_30 bitline1_30 N662 VDD pmos45hp l=0.16um w={tw}
Cmbit122 N101 0 {cap_bl}
Cmbit123 N915 0 144fF
R204 N101 bitline0_30 10000
R205 bitline1_30 N915 10000
R206 0 N531 30000
R207 N403 mb30 1000
R208 N915 N1133 1000
R209 N704 N662 25000
R210 N1076 N1075 25000
M390 bitline0_30 EqNot VDDby2 VDD pmos45hp l=0.16um w={pretw}
M391 VDDby2 EqNot bitline1_30 VDD pmos45hp l=0.16um w={pretw}
M§NMOS30 N243 N101 N031 0 nmos45hp l=0.16um w={ntw}
M§PMOS30 N243 K VDD VDD pmos45hp l=0.16um w={tw}
M392 N1073 sense_N 0 0 nmos45lp l=0.27um w=0.22um
M393 bitline1_31 bitline0_31 N1074 0 nmos45hp l=0.16um w={ntw}
M394 bitline0_31 bitline1_31 N1073 0 nmos45hp l=0.16um w={ntw}
M395 bitline1_31 Eq bitline0_31 0 nmos45hp l=0.16um w={prentw}
M396 bitline0_31 Eq VDDby2 0 nmos45hp l=0.16um w={prentw}
M397 VDDby2 Eq bitline1_31 0 nmos45hp l=0.16um w={prentw}
M398 N100 ra0 N402 0 nmos45lp l=0.085um w=0.555um
Cmbit124 mb31 N530 24fF
M399 N1132 ra3 N1425 0 nmos45lp l=0.085um w=0.055um
Cmbit125 N1425 0 24fF
M400 N661 sense_P VDD VDD pmos45lp l=0.27um w=0.22um
M401 bitline1_31 bitline0_31 N703 VDD pmos45hp l=0.16um w={tw}
M402 bitline0_31 bitline1_31 N661 VDD pmos45hp l=0.16um w={tw}
Cmbit126 N100 0 {cap_bl}
Cmbit127 N914 0 144fF
R211 N100 bitline0_31 10000
R212 bitline1_31 N914 10000
R213 0 N530 30000
R214 N402 mb31 1000
R215 N914 N1132 1000
R216 N703 N661 25000
R217 N1074 N1073 25000
M403 bitline0_31 EqNot VDDby2 VDD pmos45hp l=0.16um w={pretw}
M404 VDDby2 EqNot bitline1_31 VDD pmos45hp l=0.16um w={pretw}
M§NMOS31 N242 N100 N030 0 nmos45hp l=0.16um w={ntw}
M§PMOS31 N242 K VDD VDD pmos45hp l=0.16um w={tw}
M405 N1098 sense_N 0 0 nmos45lp l=0.27um w=0.22um
M406 bitline1_32 bitline0_32 N1099 0 nmos45hp l=0.16um w={ntw}
M407 bitline0_32 bitline1_32 N1098 0 nmos45hp l=0.16um w={ntw}
M408 bitline1_32 Eq bitline0_32 0 nmos45hp l=0.16um w={prentw}
M409 bitline0_32 Eq VDDby2 0 nmos45hp l=0.16um w={prentw}
M410 VDDby2 Eq bitline1_32 0 nmos45hp l=0.16um w={prentw}
M411 N113 ra0 N411 0 nmos45lp l=0.085um w=0.555um
Cmbit128 mb32 N539 24fF
M412 N1169 ra3 N1435 0 nmos45lp l=0.085um w=0.055um
Cmbit129 N1435 0 24fF
M413 N680 sense_P VDD VDD pmos45lp l=0.27um w=0.22um
M414 bitline1_32 bitline0_32 N726 VDD pmos45hp l=0.16um w={tw}
M415 bitline0_32 bitline1_32 N680 VDD pmos45hp l=0.16um w={tw}
Cmbit130 N113 0 {cap_bl}
Cmbit131 N923 0 144fF
R218 N113 bitline0_32 10000
R219 bitline1_32 N923 10000
R220 0 N539 30000
R221 N411 mb32 1000
R222 N923 N1169 1000
R223 N726 N680 25000
R224 N1099 N1098 25000
M416 bitline0_32 EqNot VDDby2 VDD pmos45hp l=0.16um w={pretw}
M417 VDDby2 EqNot bitline1_32 VDD pmos45hp l=0.16um w={pretw}
M§NMOS32 N261 N113 N028 0 nmos45hp l=0.16um w={ntw}
M§PMOS32 N261 K VDD VDD pmos45hp l=0.16um w={tw}
M418 N1071 sense_N 0 0 nmos45lp l=0.27um w=0.22um
M419 bitline1_33 bitline0_33 N1072 0 nmos45hp l=0.16um w={ntw}
M420 bitline0_33 bitline1_33 N1071 0 nmos45hp l=0.16um w={ntw}
M421 bitline1_33 Eq bitline0_33 0 nmos45hp l=0.16um w={prentw}
M422 bitline0_33 Eq VDDby2 0 nmos45hp l=0.16um w={prentw}
M423 VDDby2 Eq bitline1_33 0 nmos45hp l=0.16um w={prentw}
M424 N099 ra0 N401 0 nmos45lp l=0.085um w=0.555um
Cmbit132 mb33 N529 24fF
M425 N1131 ra3 N1424 0 nmos45lp l=0.085um w=0.055um
Cmbit133 N1424 0 24fF
M426 N660 sense_P VDD VDD pmos45lp l=0.27um w=0.22um
M427 bitline1_33 bitline0_33 N702 VDD pmos45hp l=0.16um w={tw}
M428 bitline0_33 bitline1_33 N660 VDD pmos45hp l=0.16um w={tw}
Cmbit134 N099 0 {cap_bl}
Cmbit135 N913 0 144fF
R225 N099 bitline0_33 10000
R226 bitline1_33 N913 10000
R227 0 N529 30000
R228 N401 mb33 1000
R229 N913 N1131 1000
R230 N702 N660 25000
R231 N1072 N1071 25000
M429 bitline0_33 EqNot VDDby2 VDD pmos45hp l=0.16um w={pretw}
M430 VDDby2 EqNot bitline1_33 VDD pmos45hp l=0.16um w={pretw}
M§NMOS33 N241 N099 N027 0 nmos45hp l=0.16um w={ntw}
M§PMOS33 N241 K VDD VDD pmos45hp l=0.16um w={tw}
M431 N1069 sense_N 0 0 nmos45lp l=0.27um w=0.22um
M432 bitline1_34 bitline0_34 N1070 0 nmos45hp l=0.16um w={ntw}
M433 bitline0_34 bitline1_34 N1069 0 nmos45hp l=0.16um w={ntw}
M434 bitline1_34 Eq bitline0_34 0 nmos45hp l=0.16um w={prentw}
M435 bitline0_34 Eq VDDby2 0 nmos45hp l=0.16um w={prentw}
M436 VDDby2 Eq bitline1_34 0 nmos45hp l=0.16um w={prentw}
M437 N098 ra0 N400 0 nmos45lp l=0.085um w=0.555um
Cmbit136 mb34 N528 24fF
M438 N1130 ra3 N1423 0 nmos45lp l=0.085um w=0.055um
Cmbit137 N1423 0 24fF
M439 N659 sense_P VDD VDD pmos45lp l=0.27um w=0.22um
M440 bitline1_34 bitline0_34 N701 VDD pmos45hp l=0.16um w={tw}
M441 bitline0_34 bitline1_34 N659 VDD pmos45hp l=0.16um w={tw}
Cmbit138 N098 0 {cap_bl}
Cmbit139 N912 0 144fF
R232 N098 bitline0_34 10000
R233 bitline1_34 N912 10000
R234 0 N528 30000
R235 N400 mb34 1000
R236 N912 N1130 1000
R237 N701 N659 25000
R238 N1070 N1069 25000
M442 bitline0_34 EqNot VDDby2 VDD pmos45hp l=0.16um w={pretw}
M443 VDDby2 EqNot bitline1_34 VDD pmos45hp l=0.16um w={pretw}
M§NMOS34 N240 N098 N026 0 nmos45hp l=0.16um w={ntw}
M§PMOS34 N240 K VDD VDD pmos45hp l=0.16um w={tw}
M444 N1167 sense_N 0 0 nmos45lp l=0.27um w=0.22um
M445 bitline1_35 bitline0_35 N1168 0 nmos45hp l=0.16um w={ntw}
M446 bitline0_35 bitline1_35 N1167 0 nmos45hp l=0.16um w={ntw}
M447 bitline1_35 Eq bitline0_35 0 nmos45hp l=0.16um w={prentw}
M448 bitline0_35 Eq VDDby2 0 nmos45hp l=0.16um w={prentw}
M449 VDDby2 Eq bitline1_35 0 nmos45hp l=0.16um w={prentw}
M450 N158 ra0 N436 0 nmos45lp l=0.085um w=0.555um
Cmbit140 mb35 N564 24fF
M451 N1232 ra3 N1460 0 nmos45lp l=0.085um w=0.055um
Cmbit141 N1460 0 24fF
M452 N725 sense_P VDD VDD pmos45lp l=0.27um w=0.22um
M453 bitline1_35 bitline0_35 N770 VDD pmos45hp l=0.16um w={tw}
M454 bitline0_35 bitline1_35 N725 VDD pmos45hp l=0.16um w={tw}
Cmbit142 N158 0 {cap_bl}
Cmbit143 N948 0 144fF
R239 N158 bitline0_35 10000
R240 bitline1_35 N948 10000
R241 0 N564 30000
R242 N436 mb35 1000
R243 N948 N1232 1000
R244 N770 N725 25000
R245 N1168 N1167 25000
M455 bitline0_35 EqNot VDDby2 VDD pmos45hp l=0.16um w={pretw}
M456 VDDby2 EqNot bitline1_35 VDD pmos45hp l=0.16um w={pretw}
M§NMOS35 N299 N158 N060 0 nmos45hp l=0.16um w={ntw}
M§PMOS35 N299 K VDD VDD pmos45hp l=0.16um w={tw}
M457 N1128 sense_N 0 0 nmos45lp l=0.27um w=0.22um
M458 bitline1_36 bitline0_36 N1129 0 nmos45hp l=0.16um w={ntw}
M459 bitline0_36 bitline1_36 N1128 0 nmos45hp l=0.16um w={ntw}
M460 bitline1_36 Eq bitline0_36 0 nmos45hp l=0.16um w={prentw}
M461 bitline0_36 Eq VDDby2 0 nmos45hp l=0.16um w={prentw}
M462 VDDby2 Eq bitline1_36 0 nmos45hp l=0.16um w={prentw}
M463 N133 ra0 N422 0 nmos45lp l=0.085um w=0.555um
Cmbit144 mb36 N550 24fF
M464 N1202 ra3 N1446 0 nmos45lp l=0.085um w=0.055um
Cmbit145 N1446 0 24fF
M465 N700 sense_P VDD VDD pmos45lp l=0.27um w=0.22um
M466 bitline1_36 bitline0_36 N748 VDD pmos45hp l=0.16um w={tw}
M467 bitline0_36 bitline1_36 N700 VDD pmos45hp l=0.16um w={tw}
Cmbit146 N133 0 {cap_bl}
Cmbit147 N934 0 144fF
R246 N133 bitline0_36 10000
R247 bitline1_36 N934 10000
R248 0 N550 30000
R249 N422 mb36 1000
R250 N934 N1202 1000
R251 N748 N700 25000
R252 N1129 N1128 25000
M468 bitline0_36 EqNot VDDby2 VDD pmos45hp l=0.16um w={pretw}
M469 VDDby2 EqNot bitline1_36 VDD pmos45hp l=0.16um w={pretw}
M§NMOS36 N278 N133 N042 0 nmos45hp l=0.16um w={ntw}
M§PMOS36 N278 K VDD VDD pmos45hp l=0.16um w={tw}
M470 N1096 sense_N 0 0 nmos45lp l=0.27um w=0.22um
M471 bitline1_37 bitline0_37 N1097 0 nmos45hp l=0.16um w={ntw}
M472 bitline0_37 bitline1_37 N1096 0 nmos45hp l=0.16um w={ntw}
M473 bitline1_37 Eq bitline0_37 0 nmos45hp l=0.16um w={prentw}
M474 bitline0_37 Eq VDDby2 0 nmos45hp l=0.16um w={prentw}
M475 VDDby2 Eq bitline1_37 0 nmos45hp l=0.16um w={prentw}
M476 N112 ra0 N410 0 nmos45lp l=0.085um w=0.555um
Cmbit148 mb37 N538 24fF
M477 N1166 ra3 N1434 0 nmos45lp l=0.085um w=0.055um
Cmbit149 N1434 0 24fF
M478 N679 sense_P VDD VDD pmos45lp l=0.27um w=0.22um
M479 bitline1_37 bitline0_37 N724 VDD pmos45hp l=0.16um w={tw}
M480 bitline0_37 bitline1_37 N679 VDD pmos45hp l=0.16um w={tw}
Cmbit150 N112 0 {cap_bl}
Cmbit151 N922 0 144fF
R253 N112 bitline0_37 10000
R254 bitline1_37 N922 10000
R255 0 N538 30000
R256 N410 mb37 1000
R257 N922 N1166 1000
R258 N724 N679 25000
R259 N1097 N1096 25000
M481 bitline0_37 EqNot VDDby2 VDD pmos45hp l=0.16um w={pretw}
M482 VDDby2 EqNot bitline1_37 VDD pmos45hp l=0.16um w={pretw}
M§NMOS37 N260 N112 N041 0 nmos45hp l=0.16um w={ntw}
M§PMOS37 N260 K VDD VDD pmos45hp l=0.16um w={tw}
M483 N1094 sense_N 0 0 nmos45lp l=0.27um w=0.22um
M484 bitline1_38 bitline0_38 N1095 0 nmos45hp l=0.16um w={ntw}
M485 bitline0_38 bitline1_38 N1094 0 nmos45hp l=0.16um w={ntw}
M486 bitline1_38 Eq bitline0_38 0 nmos45hp l=0.16um w={prentw}
M487 bitline0_38 Eq VDDby2 0 nmos45hp l=0.16um w={prentw}
M488 VDDby2 Eq bitline1_38 0 nmos45hp l=0.16um w={prentw}
M489 N111 ra0 N409 0 nmos45lp l=0.085um w=0.555um
Cmbit152 mb38 N537 24fF
M490 N1165 ra3 N1433 0 nmos45lp l=0.085um w=0.055um
Cmbit153 N1433 0 24fF
M491 N678 sense_P VDD VDD pmos45lp l=0.27um w=0.22um
M492 bitline1_38 bitline0_38 N723 VDD pmos45hp l=0.16um w={tw}
M493 bitline0_38 bitline1_38 N678 VDD pmos45hp l=0.16um w={tw}
Cmbit154 N111 0 {cap_bl}
Cmbit155 N921 0 144fF
R260 N111 bitline0_38 10000
R261 bitline1_38 N921 10000
R262 0 N537 30000
R263 N409 mb38 1000
R264 N921 N1165 1000
R265 N723 N678 25000
R266 N1095 N1094 25000
M494 bitline0_38 EqNot VDDby2 VDD pmos45hp l=0.16um w={pretw}
M495 VDDby2 EqNot bitline1_38 VDD pmos45hp l=0.16um w={pretw}
M§NMOS38 N259 N111 N040 0 nmos45hp l=0.16um w={ntw}
M§PMOS38 N259 K VDD VDD pmos45hp l=0.16um w={tw}
M496 N1163 sense_N 0 0 nmos45lp l=0.27um w=0.22um
M497 bitline1_39 bitline0_39 N1164 0 nmos45hp l=0.16um w={ntw}
M498 bitline0_39 bitline1_39 N1163 0 nmos45hp l=0.16um w={ntw}
M499 bitline1_39 Eq bitline0_39 0 nmos45hp l=0.16um w={prentw}
M500 bitline0_39 Eq VDDby2 0 nmos45hp l=0.16um w={prentw}
M501 VDDby2 Eq bitline1_39 0 nmos45hp l=0.16um w={prentw}
M502 N157 ra0 N435 0 nmos45lp l=0.085um w=0.555um
Cmbit156 mb39 N563 24fF
M503 N1231 ra3 N1459 0 nmos45lp l=0.085um w=0.055um
Cmbit157 N1459 0 24fF
M504 N722 sense_P VDD VDD pmos45lp l=0.27um w=0.22um
M505 bitline1_39 bitline0_39 N769 VDD pmos45hp l=0.16um w={tw}
M506 bitline0_39 bitline1_39 N722 VDD pmos45hp l=0.16um w={tw}
Cmbit158 N157 0 {cap_bl}
Cmbit159 N947 0 144fF
R267 N157 bitline0_39 10000
R268 bitline1_39 N947 10000
R269 0 N563 30000
R270 N435 mb39 1000
R271 N947 N1231 1000
R272 N769 N722 25000
R273 N1164 N1163 25000
M507 bitline0_39 EqNot VDDby2 VDD pmos45hp l=0.16um w={pretw}
M508 VDDby2 EqNot bitline1_39 VDD pmos45hp l=0.16um w={pretw}
M§NMOS39 N298 N157 N059 0 nmos45hp l=0.16um w={ntw}
M§PMOS39 N298 K VDD VDD pmos45hp l=0.16um w={tw}
M509 N1126 sense_N 0 0 nmos45lp l=0.27um w=0.22um
M510 bitline1_40 bitline0_40 N1127 0 nmos45hp l=0.16um w={ntw}
M511 bitline0_40 bitline1_40 N1126 0 nmos45hp l=0.16um w={ntw}
M512 bitline1_40 Eq bitline0_40 0 nmos45hp l=0.16um w={prentw}
M513 bitline0_40 Eq VDDby2 0 nmos45hp l=0.16um w={prentw}
M514 VDDby2 Eq bitline1_40 0 nmos45hp l=0.16um w={prentw}
M515 N132 ra0 N421 0 nmos45lp l=0.085um w=0.555um
Cmbit160 mb40 N549 24fF
M516 N1201 ra3 N1445 0 nmos45lp l=0.085um w=0.055um
Cmbit161 N1445 0 24fF
M517 N699 sense_P VDD VDD pmos45lp l=0.27um w=0.22um
M518 bitline1_40 bitline0_40 N747 VDD pmos45hp l=0.16um w={tw}
M519 bitline0_40 bitline1_40 N699 VDD pmos45hp l=0.16um w={tw}
Cmbit162 N132 0 {cap_bl}
Cmbit163 N933 0 144fF
R274 N132 bitline0_40 10000
R275 bitline1_40 N933 10000
R276 0 N549 30000
R277 N421 mb40 1000
R278 N933 N1201 1000
R279 N747 N699 25000
R280 N1127 N1126 25000
M520 bitline0_40 EqNot VDDby2 VDD pmos45hp l=0.16um w={pretw}
M521 VDDby2 EqNot bitline1_40 VDD pmos45hp l=0.16um w={pretw}
M§NMOS40 N277 N132 N039 0 nmos45hp l=0.16um w={ntw}
M§PMOS40 N277 K VDD VDD pmos45hp l=0.16um w={tw}
M522 N1092 sense_N 0 0 nmos45lp l=0.27um w=0.22um
M523 bitline1_41 bitline0_41 N1093 0 nmos45hp l=0.16um w={ntw}
M524 bitline0_41 bitline1_41 N1092 0 nmos45hp l=0.16um w={ntw}
M525 bitline1_41 Eq bitline0_41 0 nmos45hp l=0.16um w={prentw}
M526 bitline0_41 Eq VDDby2 0 nmos45hp l=0.16um w={prentw}
M527 VDDby2 Eq bitline1_41 0 nmos45hp l=0.16um w={prentw}
M528 N110 ra0 N408 0 nmos45lp l=0.085um w=0.555um
Cmbit164 mb41 N536 24fF
M529 N1162 ra3 N1432 0 nmos45lp l=0.085um w=0.055um
Cmbit165 N1432 0 24fF
M530 N677 sense_P VDD VDD pmos45lp l=0.27um w=0.22um
M531 bitline1_41 bitline0_41 N721 VDD pmos45hp l=0.16um w={tw}
M532 bitline0_41 bitline1_41 N677 VDD pmos45hp l=0.16um w={tw}
Cmbit166 N110 0 {cap_bl}
Cmbit167 N920 0 144fF
R281 N110 bitline0_41 10000
R282 bitline1_41 N920 10000
R283 0 N536 30000
R284 N408 mb41 1000
R285 N920 N1162 1000
R286 N721 N677 25000
R287 N1093 N1092 25000
M533 bitline0_41 EqNot VDDby2 VDD pmos45hp l=0.16um w={pretw}
M534 VDDby2 EqNot bitline1_41 VDD pmos45hp l=0.16um w={pretw}
M§NMOS41 N258 N110 N038 0 nmos45hp l=0.16um w={ntw}
M§PMOS41 N258 K VDD VDD pmos45hp l=0.16um w={tw}
M535 N1090 sense_N 0 0 nmos45lp l=0.27um w=0.22um
M536 bitline1_42 bitline0_42 N1091 0 nmos45hp l=0.16um w={ntw}
M537 bitline0_42 bitline1_42 N1090 0 nmos45hp l=0.16um w={ntw}
M538 bitline1_42 Eq bitline0_42 0 nmos45hp l=0.16um w={prentw}
M539 bitline0_42 Eq VDDby2 0 nmos45hp l=0.16um w={prentw}
M540 VDDby2 Eq bitline1_42 0 nmos45hp l=0.16um w={prentw}
M541 N109 ra0 N407 0 nmos45lp l=0.085um w=0.555um
Cmbit168 mb42 N535 24fF
M542 N1161 ra3 N1431 0 nmos45lp l=0.085um w=0.055um
Cmbit169 N1431 0 24fF
M543 N676 sense_P VDD VDD pmos45lp l=0.27um w=0.22um
M544 bitline1_42 bitline0_42 N720 VDD pmos45hp l=0.16um w={tw}
M545 bitline0_42 bitline1_42 N676 VDD pmos45hp l=0.16um w={tw}
Cmbit170 N109 0 {cap_bl}
Cmbit171 N919 0 144fF
R288 N109 bitline0_42 10000
R289 bitline1_42 N919 10000
R290 0 N535 30000
R291 N407 mb42 1000
R292 N919 N1161 1000
R293 N720 N676 25000
R294 N1091 N1090 25000
M546 bitline0_42 EqNot VDDby2 VDD pmos45hp l=0.16um w={pretw}
M547 VDDby2 EqNot bitline1_42 VDD pmos45hp l=0.16um w={pretw}
M§NMOS42 N257 N109 N037 0 nmos45hp l=0.16um w={ntw}
M§PMOS42 N257 K VDD VDD pmos45hp l=0.16um w={tw}
M548 N1199 sense_N 0 0 nmos45lp l=0.27um w=0.22um
M549 bitline1_43 bitline0_43 N1200 0 nmos45hp l=0.16um w={ntw}
M550 bitline0_43 bitline1_43 N1199 0 nmos45hp l=0.16um w={ntw}
M551 bitline1_43 Eq bitline0_43 0 nmos45hp l=0.16um w={prentw}
M552 bitline0_43 Eq VDDby2 0 nmos45hp l=0.16um w={prentw}
M553 VDDby2 Eq bitline1_43 0 nmos45hp l=0.16um w={prentw}
M554 N178 ra0 N447 0 nmos45lp l=0.085um w=0.555um
Cmbit172 mb43 N575 24fF
M555 N1261 ra3 N1471 0 nmos45lp l=0.085um w=0.055um
Cmbit173 N1471 0 24fF
M556 N746 sense_P VDD VDD pmos45lp l=0.27um w=0.22um
M557 bitline1_43 bitline0_43 N790 VDD pmos45hp l=0.16um w={tw}
M558 bitline0_43 bitline1_43 N746 VDD pmos45hp l=0.16um w={tw}
Cmbit174 N178 0 {cap_bl}
Cmbit175 N959 0 144fF
R295 N178 bitline0_43 10000
R296 bitline1_43 N959 10000
R297 0 N575 30000
R298 N447 mb43 1000
R299 N959 N1261 1000
R300 N790 N746 25000
R301 N1200 N1199 25000
M559 bitline0_43 EqNot VDDby2 VDD pmos45hp l=0.16um w={pretw}
M560 VDDby2 EqNot bitline1_43 VDD pmos45hp l=0.16um w={pretw}
M§NMOS43 N315 N178 N079 0 nmos45hp l=0.16um w={ntw}
M§PMOS43 N315 K VDD VDD pmos45hp l=0.16um w={tw}
M561 N1159 sense_N 0 0 nmos45lp l=0.27um w=0.22um
M562 bitline1_44 bitline0_44 N1160 0 nmos45hp l=0.16um w={ntw}